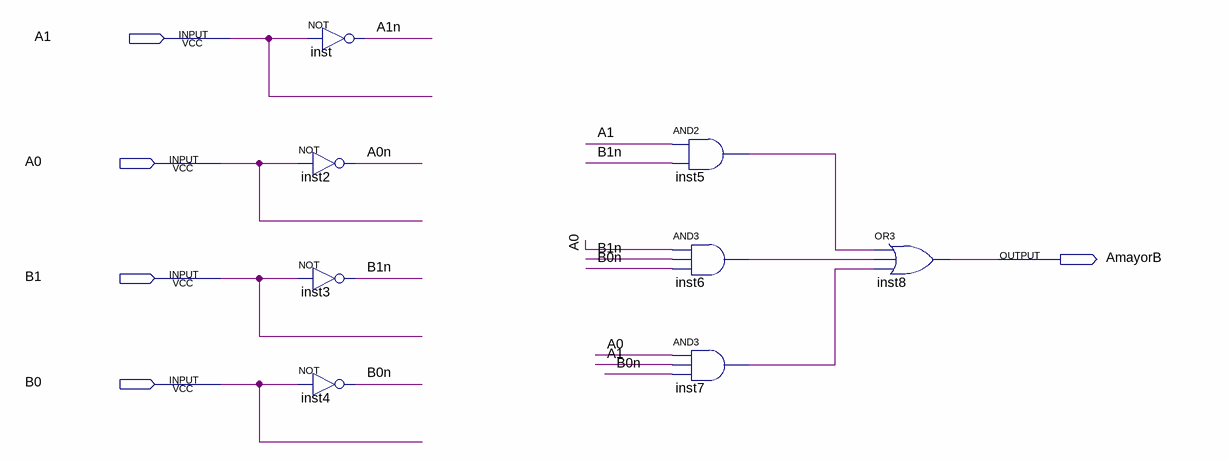
[diagram p0: schematic sheet]
// Quartus schematic Comparador.bdf as structural Verilog: 8 symbols, 5 pins
module Comparador (
  input  A1,
  input  A0,
  input  B1,
  input  B0,
  output AmayorB
);

  wire A0n, A1n, B0n, B1n, inst5_out, inst6_out, inst7_out;

  not inst (A1n, A1);
  not inst2 (A0n, A0);
  not inst3 (B1n, B1);
  not inst4 (B0n, B0);
  and inst5 (inst5_out, A1, B1n);
  and inst6 (inst6_out, A0, B1n, B0n);
  and inst7 (inst7_out, A0, A1, B0n);
  or inst8 (AmayorB, inst5_out, inst6_out, inst7_out);
endmodule
